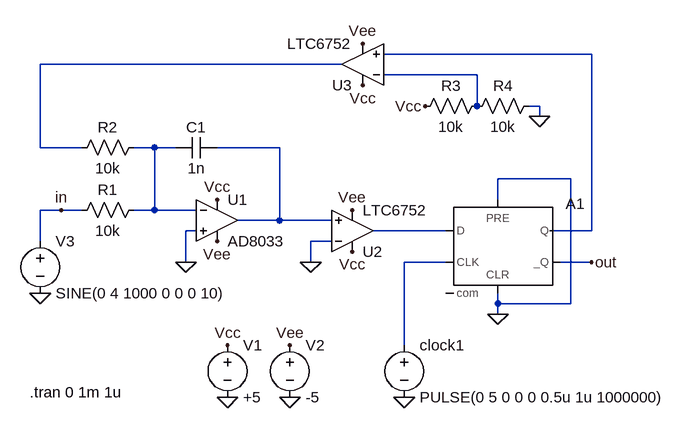
[diagram p0: schematic sigma_delta_dual.asc]
sigma_delta_dual.asc, the LTspice schematic file:
Version 4
SHEET 1 1184 680
WIRE 960 80 640 80
WIRE 576 96 112 96
WIRE 784 112 640 112
WIRE 784 160 784 112
WIRE 880 160 864 160
WIRE 880 176 880 160
WIRE 112 224 112 96
WIRE 176 224 112 224
WIRE 288 224 256 224
WIRE 320 224 288 224
WIRE 480 224 384 224
WIRE 928 272 816 272
WIRE 816 304 816 272
WIRE 144 320 112 320
WIRE 176 320 144 320
WIRE 288 320 288 224
WIRE 288 320 256 320
WIRE 352 320 288 320
WIRE 480 336 480 224
WIRE 480 336 416 336
WIRE 560 336 480 336
WIRE 352 352 336 352
WIRE 736 352 624 352
WIRE 960 352 960 80
WIRE 960 352 896 352
WIRE 112 368 112 320
WIRE 560 368 528 368
WIRE 336 400 336 352
WIRE 528 400 528 368
WIRE 736 400 672 400
WIRE 960 400 912 400
WIRE 816 464 816 448
WIRE 928 464 928 272
WIRE 928 464 816 464
WIRE 816 480 816 464
WIRE 672 528 672 400
FLAG 384 368 Vee
FLAG 496 528 Vee
FLAG 400 528 Vcc
FLAG 384 304 Vcc
FLAG 608 64 Vee
FLAG 496 608 0
FLAG 400 608 0
FLAG 704 160 Vcc
FLAG 880 176 0
FLAG 528 400 0
FLAG 816 480 0
FLAG 672 608 0
FLAG 112 448 0
FLAG 336 400 0
FLAG 608 128 Vcc
FLAG 592 320 Vee
FLAG 960 400 out
FLAG 144 320 in
FLAG 592 384 Vcc
SYMBOL voltage 496 512 R0
SYMATTR InstName V2
SYMATTR Value -5
SYMBOL voltage 400 512 R0
SYMATTR InstName V1
SYMATTR Value +5
SYMBOL res 272 304 R90
WINDOW 0 0 56 VBottom 2
WINDOW 3 32 56 VTop 2
SYMATTR InstName R1
SYMATTR Value 10k
SYMBOL res 272 208 R90
WINDOW 0 0 56 VBottom 2
WINDOW 3 32 56 VTop 2
SYMATTR InstName R2
SYMATTR Value 10k
SYMBOL res 800 144 R90
WINDOW 0 0 56 VBottom 2
WINDOW 3 32 56 VTop 2
SYMATTR InstName R3
SYMATTR Value 10k
SYMBOL res 880 144 R90
WINDOW 0 0 56 VBottom 2
WINDOW 3 32 56 VTop 2
SYMATTR InstName R4
SYMATTR Value 10k
SYMBOL cap 384 208 R90
WINDOW 0 0 32 VBottom 2
WINDOW 3 32 32 VTop 2
SYMATTR InstName C1
SYMATTR Value 1n
SYMBOL Digital/dflop 816 304 R0
SYMATTR InstName A1
SYMATTR SpiceLine Vhigh=5 Td=5n
SYMBOL voltage 672 512 R0
SYMATTR InstName clock1
SYMATTR Value PULSE(0 5 0 0 0 0.5u 1u 1000000)
SYMBOL voltage 112 352 R0
SYMATTR InstName V3
SYMATTR Value SINE(0 4 1000 0 0 0 10)
SYMBOL Comparators/LTC6752 608 160 R180
SYMATTR InstName U3
SYMBOL Comparators/LTC6752 592 416 M180
SYMATTR InstName U2
SYMBOL OpAmps/AD8033 384 272 R0
SYMATTR InstName U1
TEXT 96 600 Left 2 !.tran 0 1m 1u

The netlist it stands for:
* sigma_delta_dual.asc
V2 Vee 0 -5
V1 Vcc 0 +5
R1 N004 in 10k
R2 N004 N002 10k
R3 N003 Vcc 10k
R4 0 N003 10k
C1 N005 N004 1n
A1 N006 0 N007 0 0 out N001 0 DFLOP Vhigh=5 Td=5n
V§clock1 N007 0 PULSE(0 5 0 0 0 0.5u 1u 1000000)
V3 in 0 SINE(0 4 1000 0 0 0 10)
XU3 N001 N003 Vcc Vee N002 LTC6752  ; pins In+ In- V+ V- OUT
XU2 N005 0 Vcc Vee N006 LTC6752  ; pins In+ In- V+ V- OUT
XU1 0 N004 Vcc Vee N005 AD8033  ; pins In+ In- V+ V- OUT
.tran 0 1m 1u
.lib LTC7.lib
.backanno
.end